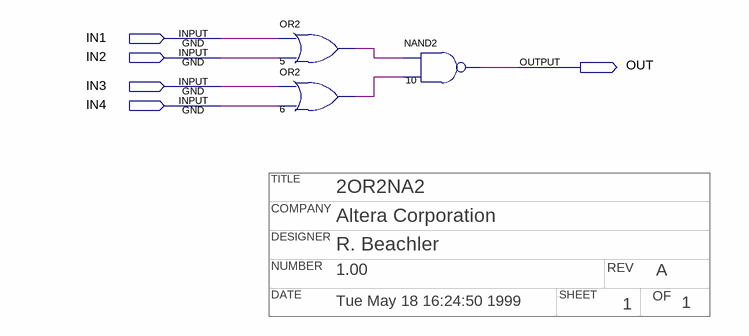
[diagram p0: schematic sheet]
// Quartus schematic 2or2na2.bdf as structural Verilog: 3 symbols, 5 pins
// Title block: TITLE: 2OR2NA2; COMPANY: Altera Corporation; DESIGNER: R. Beachler; NUMBER: 1.00; REV: A; DATE: Tue May 18 16:24:50 1999; SHEET: 1; OF: 1
module \2or2na2  (
  input  IN1,
  input  IN2,
  input  IN3,
  input  IN4,
  output OUT
);

  wire n5_out, n6_out;

  or u_5 (n5_out, IN1, IN2);
  or u_6 (n6_out, IN3, IN4);
  nand u_10 (OUT, n5_out, n6_out);
endmodule
